# Altium schematic sheet DSO_Clock.SchDoc: Schematic_Name
size A4; CompanyName: University of Melbourne; Engineer: Your Name Here; DocumentNumber: 1; Revision: 0.1; SheetNumber: 1; SheetTotal: 1; Title_Project: Project_Title; StudentNo: Student No.
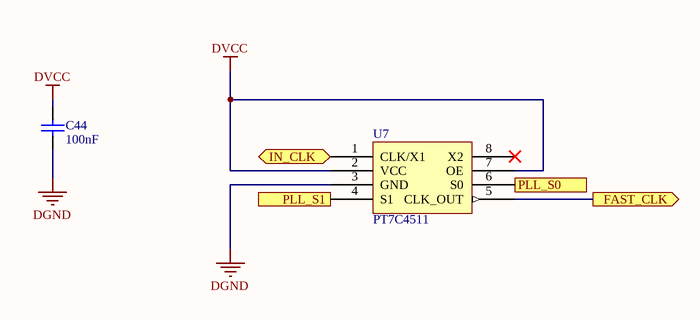
[diagram p0: DSO_Clock.SchDoc]

## Parts
C44  100nF  [0805C]
U7  PT7C4511  [SOIC-8]

## Ports
FAST_CLK (out), IN_CLK (in), PLL_S0 (in), PLL_S1 (in)

## Nets
DGND: C44.2 U7.3(GND)
DVCC: C44.1 U7.2(VCC) U7.7(OE)
FAST_CLK: U7.5(CLK_OUT) ; port FAST_CLK
IN_CLK: U7.1(CLK/X1) ; port IN_CLK
PLL_S0: U7.6(S0) ; port PLL_S0
PLL_S1: U7.4(S1) ; port PLL_S1

Not connected (* = marked no-connect by the designer): U7 8(X2)*

## Library data of the parts
C44 = c: Capacitor; Reviewed by: RM - 2018/08/05; Revision: July-2002: Re-released for DXP Platform.; Supplier 1: *; Supplier Part Number 1: *; Value: 100nF
U7 = PT7C4511: PLL Clock Multiplier; Reviewed by: RM - 2018/08/05; Supplier 1: Digi-Key; Supplier Part Number 1: PT7C4511WEXDICT-ND